# EAGLE board DRI-flexpcb-12s4p (EAGLE 9.5.2)
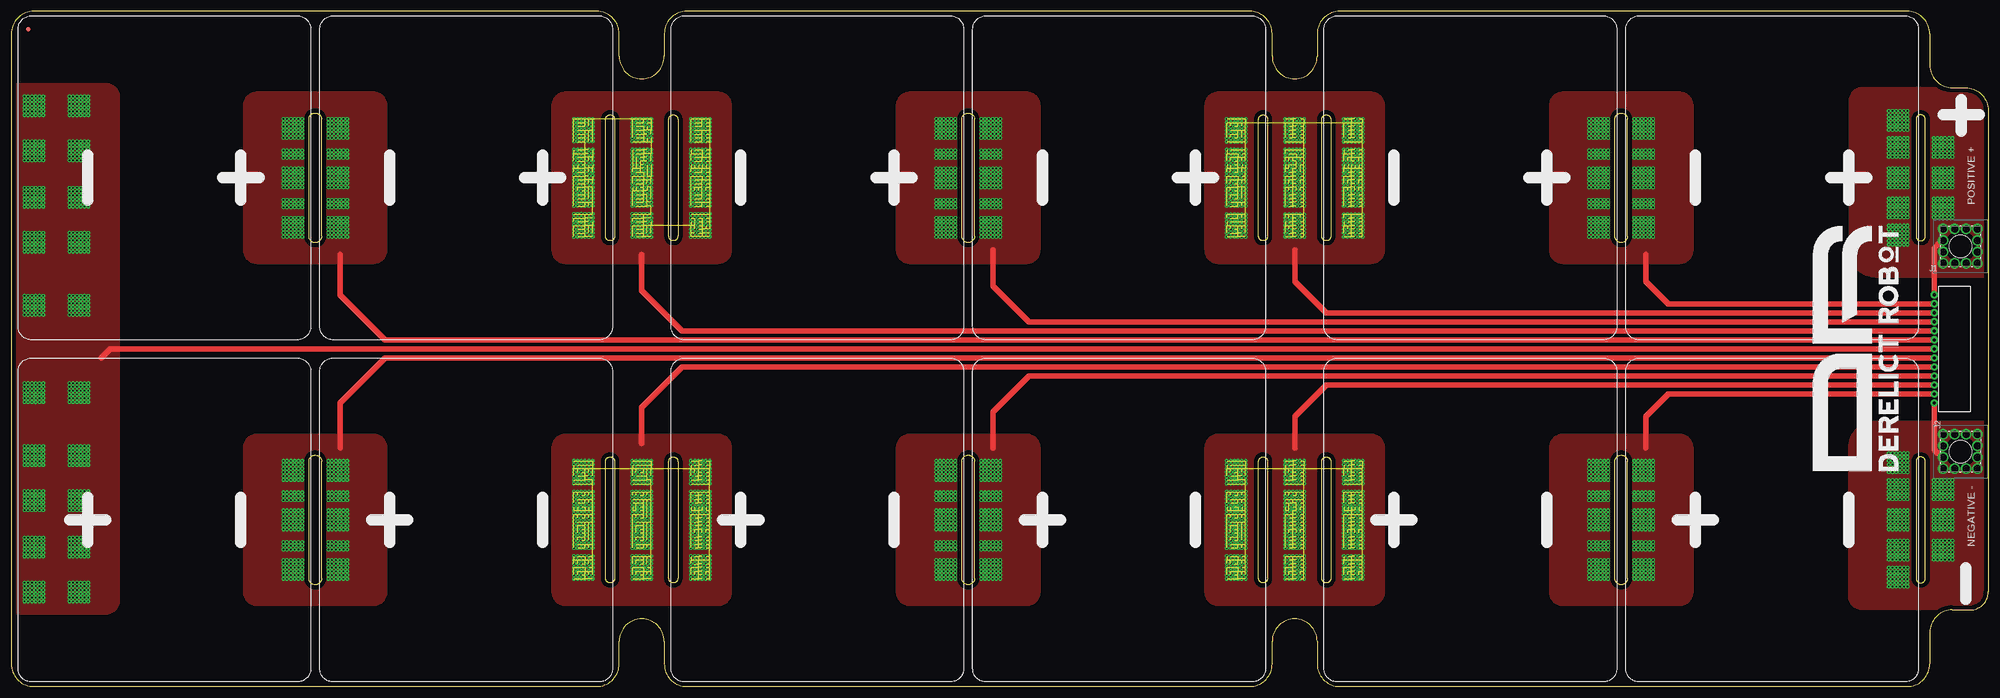
[diagram p1: board, top side]
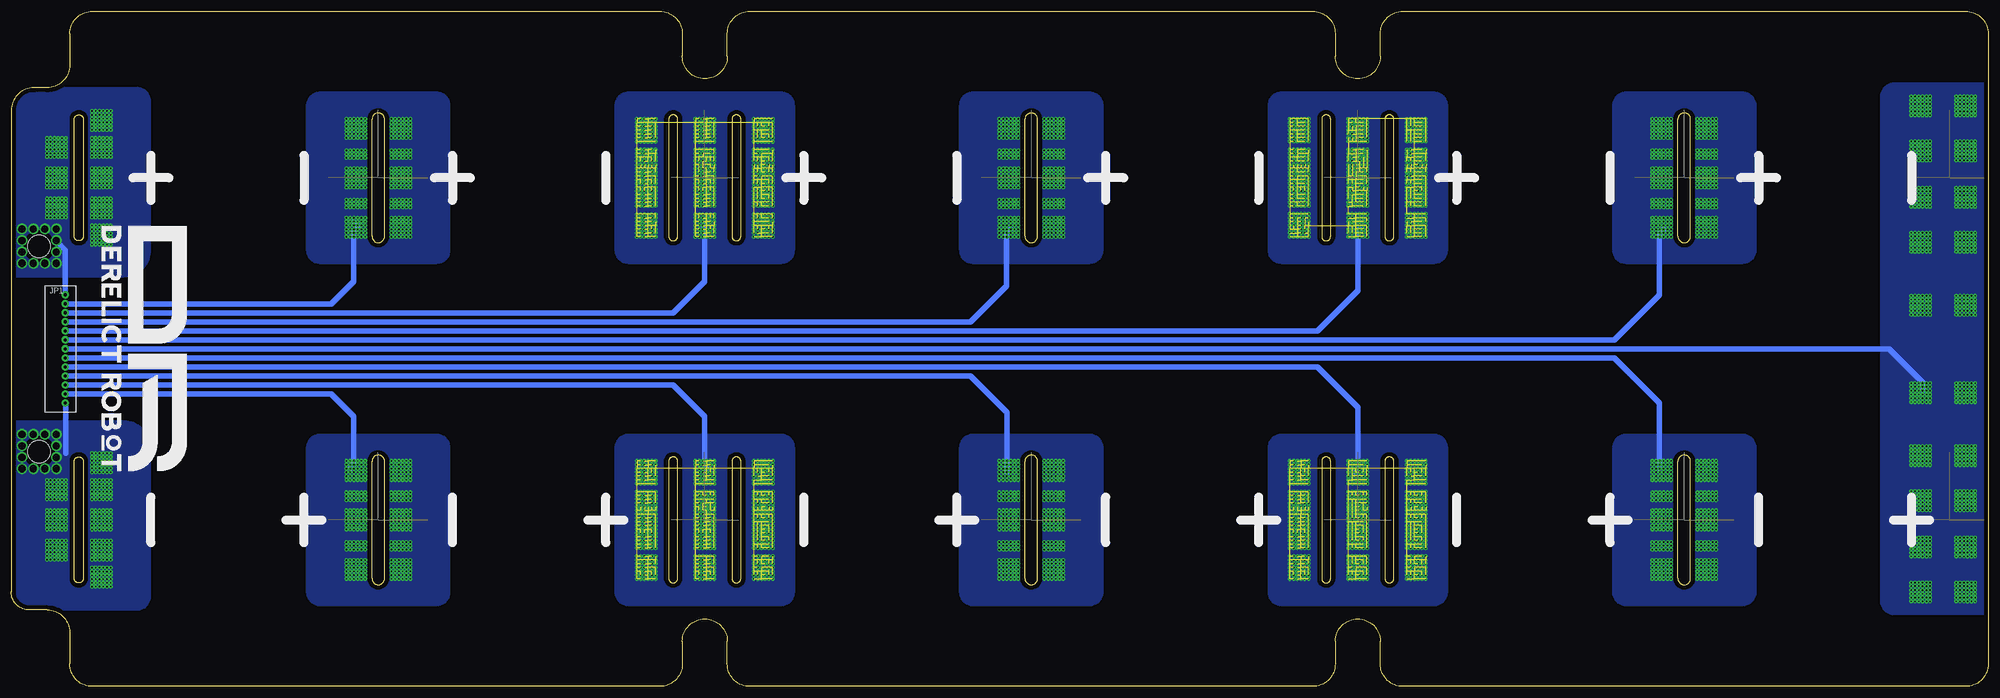
[diagram p2: board, bottom side, seen from below]

Size 439 x 150 mm. Coordinates in mm from the lower left corner, seen from the top.
Outline: 426,145 426,138 arc90 431,133 434,133 arc-90 439,128 439,127 439,21 arc-90 435,17 431,17 arc90 426,12 426,5 arc-90 421,0 295,0 arc-90 290,5 290,10 arc180 280,10 280,5 arc-90 275,0 150,0 arc-90 145,5 145,10 arc180 135,10 135,5 arc-90 130,0 5,0 arc-90 0,5 0,145 arc-90 5,150 130,150 arc-90 135,145 135,140 arc180 145,140 145,145 arc-90 150,150 275,150 arc-90 280,145 280,140 arc180 290,140 290,145 arc-90 295,150 421,150 arc-90 426,145
Copper layers (1*16): Top 0.035mm / dielectric 1.5mm / Bottom 0.035mm
Design rules "default": minimum track width 6mil, minimum drill 0.35mm, track to track 6mil, track to pad 6mil, pad to pad 6mil, via to via 6mil, smd to smd 6mil, copper to edge 40mil, drill to drill 6mil, minimum pad ring 10mil, minimum via ring 8mil, stop-mask expansion 4mil, vias tented up to drill 0mil, thermal gap 10mil

## Footprints (pad centres in the part's own frame; a part is rotated, then mirrored left to right if it is on the bottom)
FIDUCIAL-1X2 = smd 1 x 1: 1 0,0
7460408 = drill 1.57 pad 2.3: 1 0,0; 2 2.54,0; 3 5.08,0; 4 7.62,0; 5 7.62,2.54; 6 7.62,5.08; 7 7.62,7.62; 8 5.08,7.62; 9 2.54,7.62; 10 0,7.62; 11 0,5.08; 12 0,2.54 | hole 5: 3.81,3.81
13P-JST-2MM = drill 0.7 pad 1.6: P$1 0,-12; P$2 0,-10; P$3 0,-8; P$4 0,-6; P$5 0,-4; P$6 0,-2; P$7 0,0; P$8 0,2; P$9 0,4; P$10 0,6; P$11 0,8; P$12 0,10; P$13 0,12
TERM-PAD- = drill 0.3 pad 0.6: P$3 -1.26,0.42; P$4 -0.42,0.42; P$5 -0.42,-0.42; P$6 0.42,-0.42; P$7 0.42,0.42; P$8 -2.1,0.42; P$9 -2.1,1.26; P$10 -2.1,2.1; P$11 -1.26,2.1; P$12 -1.26,1.26; P$13 -0.42,1.26; P$14 -0.42,2.1; P$15 0.42,2.1; P$16 0.42,1.26; P$17 1.26,1.26; P$18 1.26,2.1; P$19 2.1,2.1; P$20 2.1,1.26; P$21 2.1,0.42; P$22 1.26,0.42; P$23 1.26,-0.42; P$24 2.1,-0.42; P$25 -1.26,-0.42; P$26 -2.1,-0.42; P$27 -2.1,-1.26; P$28 -2.1,-2.1; P$29 -1.26,-2.1; P$30 -0.42,-2.1; P$31 0.42,-2.1; P$32 1.26,-2.1; P$33 2.1,-2.1; P$34 2.1,-1.26; P$35 1.26,-1.26; P$36 -0.42,-1.26; P$37 0.42,-1.26; P$38 -1.26,-1.26; P$39 -0.42,7.14; P$40 0.42,7.14; P$41 -1.26,7.14; P$42 -2.1,7.14; P$43 -2.1,7.98; P$44 -2.1,8.82; P$45 -1.26,8.82; P$46 -1.26,7.98; P$47 -0.42,7.98; P$48 -0.42,8.82; P$49 0.42,8.82; P$50 0.42,7.98; P$51 1.26,7.98; P$52 1.26,8.82; P$53 2.1,8.82; P$54 2.1,7.98; P$55 2.1,7.14; P$56 1.26,7.14; P$57 -0.42,4.62; P$58 0.42,4.62; P$59 -1.26,4.62; P$60 -2.1,4.62; P$61 -2.1,5.46; P$62 -2.1,6.3; P$63 -1.26,6.3; P$64 -1.26,5.46; P$65 -0.42,5.46; P$66 -0.42,6.3; P$67 0.42,6.3; P$68 0.42,5.46; P$69 1.26,5.46; P$70 1.26,6.3; P$71 2.1,6.3; P$72 2.1,5.46; P$73 2.1,4.62; P$74 1.26,4.62; P$75 -0.42,-8.82; P$76 0.42,-8.82; P$77 -1.26,-8.82; P$78 -2.1,-8.82; P$79 -2.1,-7.98; P$80 -2.1,-7.14; P$81 -1.26,-7.14; P$82 -1.26,-7.98; P$83 -0.42,-7.98; P$84 -0.42,-7.14; P$85 0.42,-7.14; P$86 0.42,-7.98; P$87 1.26,-7.98; P$88 1.26,-7.14; P$89 2.1,-7.14; P$90 2.1,-7.98; P$91 2.1,-8.82; P$92 1.26,-8.82; P$93 -0.42,-6.3; P$94 0.42,-6.3; P$95 -1.26,-6.3; P$96 -2.1,-6.3; P$97 -2.1,-5.46; P$98 -2.1,-4.62; P$99 -1.26,-4.62; P$100 -1.26,-5.46; P$101 -0.42,-5.46; P$102 -0.42,-4.62; P$103 0.42,-4.62; P$104 0.42,-5.46; P$105 1.26,-5.46; P$106 1.26,-4.62; P$107 2.1,-4.62; P$108 2.1,-5.46; P$109 2.1,-6.3; P$110 1.26,-6.3; P$181 -10.42,0.42; P$182 -10.42,-0.42; P$183 -9.58,-0.42; P$184 -9.58,0.42; P$185 -11.26,0.42; P$186 -12.1,0.42; P$187 -12.1,1.26; P$188 -12.1,2.1; P$189 -11.26,2.1; P$190 -11.26,1.26; P$191 -10.42,1.26; P$192 -10.42,2.1; P$193 -9.58,2.1; P$194 -9.58,1.26; P$195 -8.74,1.26; P$196 -8.74,2.1; P$197 -7.9,2.1; P$198 -7.9,1.26; P$199 -7.9,0.42; P$200 -8.74,0.42; P$201 -8.74,-0.42; P$202 -7.9,-0.42; P$203 -11.26,-0.42; P$204 -12.1,-0.42; P$205 -12.1,-1.26; P$206 -12.1,-2.1; P$207 -11.26,-2.1; P$208 -10.42,-2.1; P$209 -9.58,-2.1; P$210 -8.74,-2.1; P$211 -7.9,-2.1; P$212 -7.9,-1.26; P$213 -8.74,-1.26; P$214 -10.42,-1.26; P$215 -9.58,-1.26; P$216 -11.26,-1.26; P$217 -10.42,7.14; P$218 -9.58,7.14; P$219 -11.26,7.14; P$220 -12.1,7.14; P$221 -12.1,7.98; P$222 -12.1,8.82; P$223 -11.26,8.82; P$224 -11.26,7.98; P$225 -10.42,7.98; P$226 -10.42,8.82; P$227 -9.58,8.82; P$228 -9.58,7.98; P$229 -8.74,7.98; P$230 -8.74,8.82; P$231 -7.9,8.82; P$232 -7.9,7.98; P$233 -7.9,7.14; P$234 -8.74,7.14; P$235 -10.42,4.62; P$236 -9.58,4.62; P$237 -11.26,4.62; P$238 -12.1,4.62; P$239 -12.1,5.46; P$240 -12.1,6.3; P$241 -11.26,6.3; P$242 -11.26,5.46; P$243 -10.42,5.46; P$244 -10.42,6.3; P$245 -9.58,6.3; P$246 -9.58,5.46; P$247 -8.74,5.46; P$248 -8.74,6.3; P$249 -7.9,6.3; P$250 -7.9,5.46; P$251 -7.9,4.62; P$252 -8.74,4.62; P$253 -10.42,-8.82; P$254 -9.58,-8.82; P$255 -11.26,-8.82; P$256 -12.1,-8.82; P$257 -12.1,-7.98; P$258 -12.1,-7.14; P$259 -11.26,-7.14; P$260 -11.26,-7.98; P$261 -10.42,-7.98; P$262 -10.42,-7.14; P$263 -9.58,-7.14; P$264 -9.58,-7.98; P$265 -8.74,-7.98; P$266 -8.74,-7.14; P$267 -7.9,-7.14; P$268 -7.9,-7.98; P$269 -7.9,-8.82; P$270 -8.74,-8.82; P$271 -10.42,-6.3; P$272 -9.58,-6.3; P$273 -11.26,-6.3; P$274 -12.1,-6.3; P$275 -12.1,-5.46; P$276 -12.1,-4.62; P$277 -11.26,-4.62; P$278 -11.26,-5.46; P$279 -10.42,-5.46; P$280 -10.42,-4.62; P$281 -9.58,-4.62; P$282 -9.58,-5.46; P$283 -8.74,-5.46; P$284 -8.74,-4.62; P$285 -7.9,-4.62; P$286 -7.9,-5.46; P$287 -7.9,-6.3; P$288 -8.74,-6.3; P$289 -10.42,13.14; P$290 -9.58,13.14; P$291 -11.26,13.14; P$292 -12.1,13.14; P$293 -12.1,13.98; P$294 -12.1,14.82; P$295 -11.26,14.82; P$296 -11.26,13.98; P$297 -10.42,13.98; P$298 -10.42,14.82; P$299 -9.58,14.82; P$300 -9.58,13.98; P$301 -8.74,13.98; P$302 -8.74,14.82; P$303 -7.9,14.82; P$304 -7.9,13.98; P$305 -7.9,13.14; P$306 -8.74,13.14; P$307 -10.42,10.62; P$308 -9.58,10.62; P$309 -11.26,10.62; P$310 -12.1,10.62; P$311 -12.1,11.46; P$312 -12.1,12.3; P$313 -11.26,12.3; P$314 -11.26,11.46; P$315 -10.42,11.46; P$316 -10.42,12.3; P$317 -9.58,12.3; P$318 -9.58,11.46; P$319 -8.74,11.46; P$320 -8.74,12.3; P$321 -7.9,12.3; P$322 -7.9,11.46; P$323 -7.9,10.62; P$324 -8.74,10.62; P$325 -10.42,-14.82; P$326 -9.58,-14.82; P$327 -11.26,-14.82; P$328 -12.1,-14.82; P$329 -12.1,-13.98; P$330 -12.1,-13.14; P$331 -11.26,-13.14; P$332 -11.26,-13.98; P$333 -10.42,-13.98; P$334 -10.42,-13.14; P$335 -9.58,-13.14; P$336 -9.58,-13.98; P$337 -8.74,-13.98; P$338 -8.74,-13.14; P$339 -7.9,-13.14; P$340 -7.9,-13.98; P$341 -7.9,-14.82; P$342 -8.74,-14.82; P$343 -10.42,-12.3; P$344 -9.58,-12.3; P$345 -11.26,-12.3; P$346 -12.1,-12.3; P$347 -12.1,-11.46; P$348 -12.1,-10.62; P$349 -11.26,-10.62; P$350 -11.26,-11.46; P$351 -10.42,-11.46; P$352 -10.42,-10.62; P$353 -9.58,-10.62; P$354 -9.58,-11.46; P$355 -8.74,-11.46; P$356 -8.74,-10.62; P$357 -7.9,-10.62; P$358 -7.9,-11.46; P$359 -7.9,-12.3; P$360 -8.74,-12.3
BAT-TERM-L = drill 0.3 pad 0.6: P$1 -5.42,-6.58; P$2 -4.58,-6.58; P$3 -4.58,-5.74; P$4 -4.58,-4.9; P$5 -5.42,0.42; P$6 -4.58,0.42; P$7 -4.58,-0.42; P$8 -5.42,-0.42; P$9 -5.42,-1.26; P$10 -5.42,-2.1; P$11 -6.26,-2.1; P$12 -7.1,-2.1; P$13 -4.58,1.26; P$14 -4.58,2.1; P$15 -3.74,2.1; P$16 -2.9,2.1; P$17 -3.74,0.42; P$18 -2.9,0.42; P$19 -2.9,1.26; P$20 -3.74,1.26; P$21 -3.74,-1.26; P$22 -3.74,-0.42; P$23 -2.9,-0.42; P$24 -2.9,-1.26; P$25 -2.9,-2.1; P$26 -3.74,-2.1; P$27 -4.58,-2.1; P$28 -4.58,-1.26; P$29 -6.26,-1.26; P$30 -7.1,-1.26; P$31 -7.1,-0.42; P$32 -6.26,-0.42; P$33 -6.26,0.42; P$34 -7.1,0.42; P$35 -7.1,1.26; P$36 -6.26,1.26; P$37 -6.26,2.1; P$38 -7.1,2.1; P$39 -5.42,1.26; P$40 -5.42,2.1; P$41 -5.42,-10.58; P$42 4.58,0.42; P$43 5.42,0.42; P$44 5.42,-0.42; P$45 4.58,-0.42; P$46 4.58,-1.26; P$47 4.58,-2.1; P$48 3.74,-2.1; P$49 2.9,-2.1; P$50 5.42,1.26; P$51 5.42,2.1; P$52 6.26,2.1; P$53 7.1,2.1; P$54 6.26,0.42; P$55 7.1,0.42; P$56 7.1,1.26; P$57 6.26,1.26; P$58 6.26,-1.26; P$59 6.26,-0.42; P$60 7.1,-0.42; P$61 7.1,-1.26; P$62 7.1,-2.1; P$63 6.26,-2.1; P$64 5.42,-2.1; P$65 5.42,-1.26; P$66 3.74,-1.26; P$67 2.9,-1.26; P$68 2.9,-0.42; P$69 3.74,-0.42; P$70 3.74,0.42; P$71 2.9,0.42; P$72 2.9,1.26; P$73 3.74,1.26; P$74 3.74,2.1; P$75 2.9,2.1; P$76 4.58,1.26; P$77 4.58,2.1; P$78 -4.58,-10.58; P$79 -4.58,-11.42; P$80 -5.42,-11.42; P$81 -5.42,-12.26; P$82 -5.42,-13.1; P$83 -6.26,-13.1; P$84 -7.1,-13.1; P$85 -4.58,-9.74; P$86 -4.58,-8.9; P$87 -3.74,-8.9; P$88 -2.9,-8.9; P$89 -3.74,-10.58; P$90 -2.9,-10.58; P$91 -2.9,-9.74; P$92 -3.74,-9.74; P$93 -3.74,-12.26; P$94 -3.74,-11.42; P$95 -2.9,-11.42; P$96 -2.9,-12.26; P$97 -2.9,-13.1; P$98 -3.74,-13.1; P$99 -4.58,-13.1; P$100 -4.58,-12.26; P$101 -6.26,-12.26; P$102 -7.1,-12.26; P$103 -7.1,-11.42; P$104 -6.26,-11.42; P$105 -6.26,-10.58; P$106 -7.1,-10.58; P$107 -7.1,-9.74; P$108 -6.26,-9.74; P$109 -6.26,-8.9; P$110 -7.1,-8.9; P$111 -5.42,-9.74; P$112 -5.42,-8.9; P$113 -3.74,-4.9; P$114 -5.42,11.42; P$115 -4.58,11.42; P$116 -4.58,10.58; P$117 -5.42,10.58; P$118 -5.42,9.74; P$119 -5.42,8.9; P$120 -6.26,8.9; P$121 -7.1,8.9; P$122 -4.58,12.26; P$123 -4.58,13.1; P$124 -3.74,13.1; P$125 -2.9,13.1; P$126 -3.74,11.42; P$127 -2.9,11.42; P$128 -2.9,12.26; P$129 -3.74,12.26; P$130 -3.74,9.74; P$131 -3.74,10.58; P$132 -2.9,10.58; P$133 -2.9,9.74; P$134 -2.9,8.9; P$135 -3.74,8.9; P$136 -4.58,8.9; P$137 -4.58,9.74; P$138 -6.26,9.74; P$139 -7.1,9.74; P$140 -7.1,10.58; P$141 -6.26,10.58; P$142 -6.26,11.42; P$143 -7.1,11.42; P$144 -7.1,12.26; P$145 -6.26,12.26; P$146 -6.26,13.1; P$147 -7.1,13.1; P$148 -5.42,12.26; P$149 -5.42,13.1; P$150 -2.9,-4.9; P$151 4.58,11.42; P$152 5.42,11.42; P$153 5.42,10.58; P$154 4.58,10.58; P$155 4.58,9.74; P$156 4.58,8.9; P$157 3.74,8.9; P$158 2.9,8.9; P$159 5.42,12.26; P$160 5.42,13.1; P$161 6.26,13.1; P$162 7.1,13.1; P$163 6.26,11.42; P$164 7.1,11.42; P$165 7.1,12.26; P$166 6.26,12.26; P$167 6.26,9.74; P$168 6.26,10.58; P$169 7.1,10.58; P$170 7.1,9.74; P$171 7.1,8.9; P$172 6.26,8.9; P$173 5.42,8.9; P$174 5.42,9.74; P$175 3.74,9.74; P$176 2.9,9.74; P$177 2.9,10.58; P$178 3.74,10.58; P$179 3.74,11.42; P$180 2.9,11.42; P$181 2.9,12.26; P$182 3.74,12.26; P$183 3.74,13.1; P$184 2.9,13.1; P$185 4.58,12.26; P$186 4.58,13.1; P$187 -3.74,-6.58; P$188 4.58,-10.58; P$189 5.42,-10.58; P$190 5.42,-11.42; P$191 4.58,-11.42; P$192 4.58,-12.26; P$193 4.58,-13.1; P$194 3.74,-13.1; P$195 2.9,-13.1; P$196 5.42,-9.74; P$197 5.42,-8.9; P$198 6.26,-8.9; P$199 7.1,-8.9; P$200 6.26,-10.58; P$201 7.1,-10.58; P$202 7.1,-9.74; P$203 6.26,-9.74; P$204 6.26,-12.26; P$205 6.26,-11.42; P$206 7.1,-11.42; P$207 7.1,-12.26; P$208 7.1,-13.1; P$209 6.26,-13.1; P$210 5.42,-13.1; P$211 5.42,-12.26; P$212 3.74,-12.26; P$213 2.9,-12.26; P$214 2.9,-11.42; P$215 3.74,-11.42; P$216 3.74,-10.58; P$217 2.9,-10.58; P$218 2.9,-9.74; P$219 3.74,-9.74; P$220 3.74,-8.9; P$221 2.9,-8.9; P$222 4.58,-9.74; P$223 4.58,-8.9; P$224 -2.9,-6.58; P$225 -2.9,-5.74; P$226 -3.74,-5.74; P$227 -6.26,-6.58; P$228 -7.1,-6.58; P$229 -7.1,-5.74; P$230 -6.26,-5.74; P$231 -6.26,-4.9; P$232 -7.1,-4.9; P$233 -5.42,-5.74; P$234 -5.42,-4.9; P$235 4.58,-6.58; P$236 5.42,-6.58; P$237 5.42,-5.74; P$238 5.42,-4.9; P$239 6.26,-4.9; P$240 7.1,-4.9; P$241 6.26,-6.58; P$242 7.1,-6.58; P$243 7.1,-5.74; P$244 6.26,-5.74; P$245 3.74,-6.58; P$246 2.9,-6.58; P$247 2.9,-5.74; P$248 3.74,-5.74; P$249 3.74,-4.9; P$250 2.9,-4.9; P$251 4.58,-5.74; P$252 4.58,-4.9; P$253 -5.42,4.42; P$254 -4.58,4.42; P$255 -4.58,5.26; P$256 -4.58,6.1; P$257 -3.74,6.1; P$258 -2.9,6.1; P$259 -3.74,4.42; P$260 -2.9,4.42; P$261 -2.9,5.26; P$262 -3.74,5.26; P$263 -6.26,4.42; P$264 -7.1,4.42; P$265 -7.1,5.26; P$266 -6.26,5.26; P$267 -6.26,6.1; P$268 -7.1,6.1; P$269 -5.42,5.26; P$270 -5.42,6.1; P$271 4.58,4.42; P$272 5.42,4.42; P$273 5.42,5.26; P$274 5.42,6.1; P$275 6.26,6.1; P$276 7.1,6.1; P$277 6.26,4.42; P$278 7.1,4.42; P$279 7.1,5.26; P$280 6.26,5.26; P$281 3.74,4.42; P$282 2.9,4.42; P$283 2.9,5.26; P$284 3.74,5.26; P$285 3.74,6.1; P$286 2.9,6.1; P$287 4.58,5.26; P$288 4.58,6.1
BAT-TERM-M = drill 0.3 pad 0.6: P$1 -15.08,-0.42; P$2 -15.08,0.42; P$3 -2.08,4.58; P$4 -2.08,5.42; P$5 -14.24,0.42; P$6 -13.4,0.42; P$7 -2.08,-0.42; P$8 -2.08,0.42; P$9 -1.24,0.42; P$10 -0.4,0.42; P$11 -0.4,1.26; P$12 -0.4,2.1; P$13 -1.24,-0.42; P$14 -0.4,-0.42; P$15 -0.4,-1.26; P$16 -0.4,-2.1; P$17 -1.24,-2.1; P$18 -2.08,-2.1; P$19 -13.4,1.26; P$20 -1.24,5.42; P$21 -13.4,2.1; P$22 -2.08,-8.08; P$23 -1.24,-8.08; P$24 -0.4,5.42; P$25 -0.4,6.26; P$26 -14.24,-0.42; P$27 -2.08,-1.26; P$28 -1.24,-1.26; P$29 -1.24,1.26; P$30 -1.24,2.1; P$31 -2.08,2.1; P$32 -2.08,1.26; P$33 -13.4,-0.42; P$34 -13.4,-1.26; P$35 -13.4,-2.1; P$36 -1.24,4.58; P$37 -0.4,4.58; P$38 -0.4,-8.08; P$39 -0.4,3.74; P$40 2.08,-8.08; P$41 -0.4,2.9; P$42 2.08,0.42; P$43 2.08,-0.42; P$44 -14.24,-2.1; P$45 -15.08,-2.1; P$46 -1.24,2.9; P$47 -15.08,-1.26; P$48 -2.08,2.9; P$49 1.24,-8.08; P$50 -14.24,-1.26; P$51 0.4,-8.08; P$52 -14.24,1.26; P$53 -2.08,8.02; P$54 -14.24,2.1; P$55 -15.08,2.1; P$56 2.08,-2.1; P$57 1.24,-2.1; P$58 0.4,-2.1; P$59 0.4,-1.26; P$60 0.4,-0.42; P$61 1.24,-0.42; P$62 1.24,-1.26; P$63 2.08,-1.26; P$64 -15.08,1.26; P$65 -2.08,3.74; P$66 -1.24,3.74; P$67 -1.24,6.26; P$68 -10.92,0.42; P$69 -10.92,-0.42; P$70 2.08,1.26; P$71 2.08,2.1; P$72 1.24,2.1; P$73 1.24,1.26; P$74 1.24,0.42; P$75 0.4,0.42; P$76 0.4,1.26; P$77 0.4,2.1; P$78 -10.92,-2.1; P$79 -11.76,-2.1; P$80 -12.6,-2.1; P$81 -2.08,10.58; P$82 -2.08,11.42; P$83 -1.24,11.42; P$84 -0.4,11.42; P$85 -0.4,12.26; P$86 -0.4,13.1; P$87 -1.24,10.58; P$88 -0.4,10.58; P$89 -0.4,9.74; P$90 -0.4,8.9; P$91 -1.24,8.9; P$92 -2.08,8.9; P$93 -12.6,-1.26; P$94 -12.6,-0.42; P$95 -1.24,8.02; P$96 -0.4,8.02; P$97 -2.08,6.26; P$98 -11.76,-0.42; P$99 -11.76,-1.26; P$100 -10.92,-1.26; P$101 -2.08,9.74; P$102 -1.24,9.74; P$103 -1.24,12.26; P$104 -1.24,13.1; P$105 -2.08,13.1; P$106 -2.08,12.26; P$107 -10.92,1.26; P$108 -10.92,2.1; P$109 2.08,5.42; P$110 2.08,4.58; P$111 -11.76,2.1; P$112 2.08,8.02; P$113 -11.76,1.26; P$114 -11.76,0.42; P$115 -12.6,0.42; P$116 -12.6,1.26; P$117 -12.6,2.1; P$118 -2.08,-11.42; P$119 -2.08,-10.58; P$120 -1.24,-10.58; P$121 -0.4,-10.58; P$122 -0.4,-9.74; P$123 -0.4,-8.9; P$124 -1.24,-11.42; P$125 -0.4,-11.42; P$126 -0.4,-12.26; P$127 -0.4,-13.1; P$128 -1.24,-13.1; P$129 -2.08,-13.1; P$130 -15.08,10.58; P$131 2.08,2.9; P$132 1.24,8.02; P$133 0.4,8.02; P$134 1.24,2.9; P$135 0.4,2.9; P$136 0.4,3.74; P$137 -15.08,11.42; P$138 -2.08,-12.26; P$139 -1.24,-12.26; P$140 -1.24,-9.74; P$141 -1.24,-8.9; P$142 -2.08,-8.9; P$143 -2.08,-9.74; P$144 -14.24,11.42; P$145 -13.4,11.42; P$146 0.4,4.58; P$147 1.24,4.58; P$148 1.24,3.74; P$149 2.08,3.74; P$150 -13.4,12.26; P$151 -13.4,13.1; P$152 -14.24,10.58; P$153 2.08,-10.58; P$154 2.08,-11.42; P$155 -13.4,10.58; P$156 -13.4,9.74; P$157 2.08,6.26; P$158 -13.4,8.9; P$159 -14.24,8.9; P$160 1.24,6.26; P$161 1.24,5.42; P$162 0.4,5.42; P$163 0.4,6.26; P$164 -15.08,8.9; P$165 -15.08,9.74; P$166 -14.24,9.74; P$167 2.08,-13.1; P$168 1.24,-13.1; P$169 0.4,-13.1; P$170 0.4,-12.26; P$171 0.4,-11.42; P$172 1.24,-11.42; P$173 1.24,-12.26; P$174 2.08,-12.26; P$175 -14.24,12.26; P$176 -14.24,13.1; P$177 -2.08,-5.42; P$178 -2.08,-4.58; P$179 -15.08,13.1; P$180 -15.08,12.26; P$181 2.08,-9.74; P$182 2.08,-8.9; P$183 1.24,-8.9; P$184 1.24,-9.74; P$185 1.24,-10.58; P$186 0.4,-10.58; P$187 0.4,-9.74; P$188 0.4,-8.9; P$189 -1.24,-4.58; P$190 2.08,11.42; P$191 2.08,10.58; P$192 -15.08,-11.42; P$193 -15.08,-10.58; P$194 -0.4,-4.58; P$195 -0.4,-3.74; P$196 -0.4,-2.9; P$197 -1.24,-5.42; P$198 -0.4,-5.42; P$199 -0.4,-6.26; P$200 -14.24,-10.58; P$201 -13.4,-10.58; P$202 -13.4,-9.74; P$203 -13.4,-8.9; P$204 2.08,8.9; P$205 1.24,8.9; P$206 0.4,8.9; P$207 0.4,9.74; P$208 0.4,10.58; P$209 1.24,10.58; P$210 1.24,9.74; P$211 2.08,9.74; P$212 -14.24,-11.42; P$213 -13.4,-11.42; P$214 -13.4,-12.26; P$215 -2.08,-6.26; P$216 -13.4,-13.1; P$217 -14.24,-13.1; P$218 2.08,12.26; P$219 2.08,13.1; P$220 1.24,13.1; P$221 1.24,12.26; P$222 1.24,11.42; P$223 0.4,11.42; P$224 0.4,12.26; P$225 0.4,13.1; P$226 -1.24,-6.26; P$227 -1.24,-3.74; P$228 -1.24,-2.9; P$229 -2.08,-2.9; P$230 -2.08,-3.74; P$231 -15.08,-13.1; P$232 -15.08,-12.26; P$233 2.08,-4.58; P$234 2.08,-5.42; P$235 -14.24,-12.26; P$236 -14.24,-9.74; P$237 -14.24,-8.9; P$238 -15.08,-8.9; P$239 -15.08,-9.74; P$240 -10.92,-10.58; P$241 0.4,-6.26; P$242 0.4,-5.42; P$243 1.24,-5.42; P$244 1.24,-6.26; P$245 2.08,-6.26; P$246 -10.92,-11.42; P$247 -10.92,-13.1; P$248 -11.76,-13.1; P$249 2.08,-3.74; P$250 2.08,-2.9; P$251 1.24,-2.9; P$252 1.24,-3.74; P$253 1.24,-4.58; P$254 0.4,-4.58; P$255 0.4,-3.74; P$256 0.4,-2.9; P$257 -12.6,-13.1; P$258 -12.6,-12.26; P$259 -12.6,-11.42; P$260 -11.76,-11.42; P$261 -11.76,-12.26; P$262 -10.92,-12.26; P$263 -10.92,-9.74; P$264 -10.92,-8.9; P$265 -11.76,-8.9; P$266 -11.76,-9.74; P$267 -11.76,-10.58; P$268 -12.6,-10.58; P$269 -12.6,-9.74; P$270 -12.6,-8.9; P$271 -10.92,11.42; P$272 -10.92,10.58; P$273 -10.92,8.9; P$274 -11.76,8.9; P$275 -12.6,8.9; P$276 -12.6,9.74; P$277 -12.6,10.58; P$278 -11.76,10.58; P$279 -11.76,9.74; P$280 -10.92,9.74; P$281 -10.92,12.26; P$282 -10.92,13.1; P$283 -11.76,13.1; P$284 -11.76,12.26; P$285 -11.76,11.42; P$286 -12.6,11.42; P$287 -12.6,12.26; P$288 -12.6,13.1; P$289 -15.08,-8.08; P$290 -14.24,-8.08; P$291 -13.4,-8.08; P$292 -10.92,-8.08; P$293 -11.76,-8.08; P$294 -12.6,-8.08; P$295 -15.08,8.02; P$296 -14.24,8.02; P$297 -13.4,8.02; P$298 -10.92,8.02; P$299 -11.76,8.02; P$300 -12.6,8.02; P$301 -15.08,4.58; P$302 -15.08,5.42; P$303 -14.24,5.42; P$304 -13.4,5.42; P$305 -13.4,6.26; P$306 -14.24,4.58; P$307 -13.4,4.58; P$308 -13.4,3.74; P$309 -13.4,2.9; P$310 -14.24,2.9; P$311 -15.08,2.9; P$312 -15.08,3.74; P$313 -14.24,3.74; P$314 -14.24,6.26; P$315 -15.08,6.26; P$316 -10.92,5.42; P$317 -10.92,4.58; P$318 -10.92,2.9; P$319 -11.76,2.9; P$320 -12.6,2.9; P$321 -12.6,3.74; P$322 -12.6,4.58; P$323 -11.76,4.58; P$324 -11.76,3.74; P$325 -10.92,3.74; P$326 -10.92,6.26; P$327 -11.76,6.26; P$328 -11.76,5.42; P$329 -12.6,5.42; P$330 -12.6,6.26; P$331 -15.08,-5.42; P$332 -15.08,-4.58; P$333 -14.24,-4.58; P$334 -13.4,-4.58; P$335 -13.4,-3.74; P$336 -13.4,-2.9; P$337 -14.24,-5.42; P$338 -13.4,-5.42; P$339 -13.4,-6.26; P$340 -15.08,-6.26; P$341 -14.24,-6.26; P$342 -14.24,-3.74; P$343 -14.24,-2.9; P$344 -15.08,-2.9; P$345 -15.08,-3.74; P$346 -10.92,-4.58; P$347 -10.92,-5.42; P$348 -12.6,-6.26; P$349 -12.6,-5.42; P$350 -11.76,-5.42; P$351 -11.76,-6.26; P$352 -10.92,-6.26; P$353 -10.92,-3.74; P$354 -10.92,-2.9; P$355 -11.76,-2.9; P$356 -11.76,-3.74; P$357 -11.76,-4.58; P$358 -12.6,-4.58; P$359 -12.6,-3.74; P$360 -12.6,-2.9; P$361 10.92,-0.42; P$362 10.92,0.42; P$363 11.76,0.42; P$364 12.6,0.42; P$365 12.6,1.26; P$366 12.6,2.1; P$367 11.76,-0.42; P$368 12.6,-0.42; P$369 12.6,-1.26; P$370 12.6,-2.1; P$371 11.76,-2.1; P$372 10.92,-2.1; P$373 10.92,-1.26; P$374 11.76,-1.26; P$375 11.76,1.26; P$376 11.76,2.1; P$377 10.92,2.1; P$378 10.92,1.26; P$379 15.08,0.42; P$380 15.08,-0.42; P$381 15.08,-2.1; P$382 14.24,-2.1; P$383 13.4,-2.1; P$384 13.4,-1.26; P$385 13.4,-0.42; P$386 14.24,-0.42; P$387 14.24,-1.26; P$388 15.08,-1.26; P$389 15.08,1.26; P$390 15.08,2.1; P$391 14.24,2.1; P$392 14.24,1.26; P$393 14.24,0.42; P$394 13.4,0.42; P$395 13.4,1.26; P$396 13.4,2.1; P$397 10.92,10.58; P$398 10.92,11.42; P$399 11.76,11.42; P$400 12.6,11.42; P$401 12.6,12.26; P$402 12.6,13.1; P$403 11.76,10.58; P$404 12.6,10.58; P$405 12.6,9.74; P$406 12.6,8.9; P$407 11.76,8.9; P$408 10.92,8.9; P$409 10.92,9.74; P$410 11.76,9.74; P$411 11.76,12.26; P$412 11.76,13.1; P$413 10.92,13.1; P$414 10.92,12.26; P$415 10.92,-11.42; P$416 10.92,-10.58; P$417 11.76,-10.58; P$418 12.6,-10.58; P$419 12.6,-9.74; P$420 12.6,-8.9; P$421 11.76,-11.42; P$422 12.6,-11.42; P$423 12.6,-12.26; P$424 12.6,-13.1; P$425 11.76,-13.1; P$426 10.92,-13.1; P$427 10.92,-12.26; P$428 11.76,-12.26; P$429 11.76,-9.74; P$430 11.76,-8.9; P$431 10.92,-8.9; P$432 10.92,-9.74; P$433 15.08,-10.58; P$434 15.08,-11.42; P$435 15.08,-13.1; P$436 14.24,-13.1; P$437 13.4,-13.1; P$438 13.4,-12.26; P$439 13.4,-11.42; P$440 14.24,-11.42; P$441 14.24,-12.26; P$442 15.08,-12.26; P$443 15.08,-9.74; P$444 15.08,-8.9; P$445 14.24,-8.9; P$446 14.24,-9.74; P$447 14.24,-10.58; P$448 13.4,-10.58; P$449 13.4,-9.74; P$450 13.4,-8.9; P$451 15.08,11.42; P$452 15.08,10.58; P$453 15.08,8.9; P$454 14.24,8.9; P$455 13.4,8.9; P$456 13.4,9.74; P$457 13.4,10.58; P$458 14.24,10.58; P$459 14.24,9.74; P$460 15.08,9.74; P$461 15.08,12.26; P$462 15.08,13.1; P$463 14.24,13.1; P$464 14.24,12.26; P$465 14.24,11.42; P$466 13.4,11.42; P$467 13.4,12.26; P$468 13.4,13.1; P$469 10.92,-8.08; P$470 11.76,-8.08; P$471 12.6,-8.08; P$472 15.08,-8.08; P$473 14.24,-8.08; P$474 13.4,-8.08; P$475 10.92,8.02; P$476 11.76,8.02; P$477 12.6,8.02; P$478 15.08,8.02; P$479 14.24,8.02; P$480 13.4,8.02; P$481 10.92,4.58; P$482 10.92,5.42; P$483 11.76,5.42; P$484 12.6,5.42; P$485 12.6,6.26; P$486 11.76,4.58; P$487 12.6,4.58; P$488 12.6,3.74; P$489 12.6,2.9; P$490 11.76,2.9; P$491 10.92,2.9; P$492 10.92,3.74; P$493 11.76,3.74; P$494 11.76,6.26; P$495 10.92,6.26; P$496 15.08,5.42; P$497 15.08,4.58; P$498 15.08,2.9; P$499 14.24,2.9; P$500 13.4,2.9; P$501 13.4,3.74; P$502 13.4,4.58; P$503 14.24,4.58; P$504 14.24,3.74; P$505 15.08,3.74; P$506 15.08,6.26; P$507 14.24,6.26; P$508 14.24,5.42; P$509 13.4,5.42; P$510 13.4,6.26; P$511 10.92,-5.42; P$512 10.92,-4.58; P$513 11.76,-4.58; P$514 12.6,-4.58; P$515 12.6,-3.74; P$516 12.6,-2.9; P$517 11.76,-5.42; P$518 12.6,-5.42; P$519 12.6,-6.26; P$520 10.92,-6.26; P$521 11.76,-6.26; P$522 11.76,-3.74; P$523 11.76,-2.9; P$524 10.92,-2.9; P$525 10.92,-3.74; P$526 15.08,-4.58; P$527 15.08,-5.42; P$528 13.4,-6.26; P$529 13.4,-5.42; P$530 14.24,-5.42; P$531 14.24,-6.26; P$532 15.08,-6.26; P$533 15.08,-3.74; P$534 15.08,-2.9; P$535 14.24,-2.9; P$536 14.24,-3.74; P$537 14.24,-4.58; P$538 13.4,-4.58; P$539 13.4,-3.74; P$540 13.4,-2.9
BAT-TERM-END = drill 0.3 pad 0.6: P$1 3.58,14.42; P$2 3.58,4.42; P$3 3.58,3.58; P$4 4.42,3.58; P$5 4.42,4.42; P$6 3.58,5.26; P$7 3.58,6.1; P$8 2.74,6.1; P$9 1.9,6.1; P$10 1.9,5.26; P$11 1.9,4.42; P$12 1.9,3.58; P$13 1.9,2.74; P$14 1.9,1.9; P$15 2.74,1.9; P$16 3.58,1.9; P$17 5.26,1.9; P$18 4.42,1.9; P$19 6.1,1.9; P$20 6.1,2.74; P$21 6.1,3.58; P$22 6.1,4.42; P$23 6.1,5.26; P$24 6.1,6.1; P$25 5.26,6.1; P$26 4.42,6.1; P$27 4.42,5.26; P$28 5.26,5.26; P$29 5.26,4.42; P$30 5.26,3.58; P$31 5.26,2.74; P$32 4.42,2.74; P$33 3.58,2.74; P$34 2.74,2.74; P$35 2.74,3.58; P$36 2.74,4.42; P$37 2.74,5.26; P$38 3.58,13.58; P$39 13.58,4.42; P$40 13.58,3.58; P$41 14.42,3.58; P$42 14.42,4.42; P$43 13.58,5.26; P$44 13.58,6.1; P$45 12.74,6.1; P$46 11.9,6.1; P$47 11.9,5.26; P$48 11.9,4.42; P$49 11.9,3.58; P$50 11.9,2.74; P$51 11.9,1.9; P$52 12.74,1.9; P$53 13.58,1.9; P$54 15.26,1.9; P$55 14.42,1.9; P$56 16.1,1.9; P$57 16.1,2.74; P$58 16.1,3.58; P$59 16.1,4.42; P$60 16.1,5.26; P$61 16.1,6.1; P$62 15.26,6.1; P$63 14.42,6.1; P$64 14.42,5.26; P$65 15.26,5.26; P$66 15.26,4.42; P$67 15.26,3.58; P$68 15.26,2.74; P$69 14.42,2.74; P$70 13.58,2.74; P$71 12.74,2.74; P$72 12.74,3.58; P$73 12.74,4.42; P$74 12.74,5.26; P$75 4.42,13.58; P$76 3.58,24.72; P$77 3.58,23.88; P$78 4.42,23.88; P$79 4.42,24.72; P$80 3.58,25.56; P$81 3.58,26.4; P$82 2.74,26.4; P$83 1.9,26.4; P$84 1.9,25.56; P$85 1.9,24.72; P$86 1.9,23.88; P$87 1.9,23.04; P$88 1.9,22.2; P$89 2.74,22.2; P$90 3.58,22.2; P$91 5.26,22.2; P$92 4.42,22.2; P$93 6.1,22.2; P$94 6.1,23.04; P$95 6.1,23.88; P$96 6.1,24.72; P$97 6.1,25.56; P$98 6.1,26.4; P$99 5.26,26.4; P$100 4.42,26.4; P$101 4.42,25.56; P$102 5.26,25.56; P$103 5.26,24.72; P$104 5.26,23.88; P$105 5.26,23.04; P$106 4.42,23.04; P$107 3.58,23.04; P$108 2.74,23.04; P$109 2.74,23.88; P$110 2.74,24.72; P$111 2.74,25.56; P$112 4.42,14.42; P$113 13.58,24.72; P$114 13.58,23.88; P$115 14.42,23.88; P$116 14.42,24.72; P$117 13.58,25.56; P$118 13.58,26.4; P$119 12.74,26.4; P$120 11.9,26.4; P$121 11.9,25.56; P$122 11.9,24.72; P$123 11.9,23.88; P$124 11.9,23.04; P$125 11.9,22.2; P$126 12.74,22.2; P$127 13.58,22.2; P$128 15.26,22.2; P$129 14.42,22.2; P$130 16.1,22.2; P$131 16.1,23.04; P$132 16.1,23.88; P$133 16.1,24.72; P$134 16.1,25.56; P$135 16.1,26.4; P$136 15.26,26.4; P$137 14.42,26.4; P$138 14.42,25.56; P$139 15.26,25.56; P$140 15.26,24.72; P$141 15.26,23.88; P$142 15.26,23.04; P$143 14.42,23.04; P$144 13.58,23.04; P$145 12.74,23.04; P$146 12.74,23.88; P$147 12.74,24.72; P$148 12.74,25.56; P$149 3.58,15.26; P$150 14.42,111.58; P$151 14.42,112.42; P$152 13.58,112.42; P$153 13.58,111.58; P$154 14.42,110.74; P$155 14.42,109.9; P$156 15.26,109.9; P$157 16.1,109.9; P$158 16.1,110.74; P$159 16.1,111.58; P$160 16.1,112.42; P$161 16.1,113.26; P$162 16.1,114.1; P$163 15.26,114.1; P$164 14.42,114.1; P$165 12.74,114.1; P$166 13.58,114.1; P$167 11.9,114.1; P$168 11.9,113.26; P$169 11.9,112.42; P$170 11.9,111.58; P$171 11.9,110.74; P$172 11.9,109.9; P$173 12.74,109.9; P$174 13.58,109.9; P$175 13.58,110.74; P$176 12.74,110.74; P$177 12.74,111.58; P$178 12.74,112.42; P$179 12.74,113.26; P$180 13.58,113.26; P$181 14.42,113.26; P$182 15.26,113.26; P$183 15.26,112.42; P$184 15.26,111.58; P$185 15.26,110.74; P$186 3.58,16.1; P$187 4.42,111.58; P$188 4.42,112.42; P$189 3.58,112.42; P$190 3.58,111.58; P$191 4.42,110.74; P$192 4.42,109.9; P$193 5.26,109.9; P$194 6.1,109.9; P$195 6.1,110.74; P$196 6.1,111.58; P$197 6.1,112.42; P$198 6.1,113.26; P$199 6.1,114.1; P$200 5.26,114.1; P$201 4.42,114.1; P$202 2.74,114.1; P$203 3.58,114.1; P$204 1.9,114.1; P$205 1.9,113.26; P$206 1.9,112.42; P$207 1.9,111.58; P$208 1.9,110.74; P$209 1.9,109.9; P$210 2.74,109.9; P$211 3.58,109.9; P$212 3.58,110.74; P$213 2.74,110.74; P$214 2.74,111.58; P$215 2.74,112.42; P$216 2.74,113.26; P$217 3.58,113.26; P$218 4.42,113.26; P$219 5.26,113.26; P$220 5.26,112.42; P$221 5.26,111.58; P$222 5.26,110.74; P$223 2.74,16.1; P$224 14.42,91.28; P$225 14.42,92.12; P$226 13.58,92.12; P$227 13.58,91.28; P$228 14.42,90.44; P$229 14.42,89.6; P$230 15.26,89.6; P$231 16.1,89.6; P$232 16.1,90.44; P$233 16.1,91.28; P$234 16.1,92.12; P$235 16.1,92.96; P$236 16.1,93.8; P$237 15.26,93.8; P$238 14.42,93.8; P$239 12.74,93.8; P$240 13.58,93.8; P$241 11.9,93.8; P$242 11.9,92.96; P$243 11.9,92.12; P$244 11.9,91.28; P$245 11.9,90.44; P$246 11.9,89.6; P$247 12.74,89.6; P$248 13.58,89.6; P$249 13.58,90.44; P$250 12.74,90.44; P$251 12.74,91.28; P$252 12.74,92.12; P$253 12.74,92.96; P$254 13.58,92.96; P$255 14.42,92.96; P$256 15.26,92.96; P$257 15.26,92.12; P$258 15.26,91.28; P$259 15.26,90.44; P$260 1.9,16.1; P$261 4.42,91.28; P$262 4.42,92.12; P$263 3.58,92.12; P$264 3.58,91.28; P$265 4.42,90.44; P$266 4.42,89.6; P$267 5.26,89.6; P$268 6.1,89.6; P$269 6.1,90.44; P$270 6.1,91.28; P$271 6.1,92.12; P$272 6.1,92.96; P$273 6.1,93.8; P$274 5.26,93.8; P$275 4.42,93.8; P$276 2.74,93.8; P$277 3.58,93.8; P$278 1.9,93.8; P$279 1.9,92.96; P$280 1.9,92.12; P$281 1.9,91.28; P$282 1.9,90.44; P$283 1.9,89.6; P$284 2.74,89.6; P$285 3.58,89.6; P$286 3.58,90.44; P$287 2.74,90.44; P$288 2.74,91.28; P$289 2.74,92.12; P$290 2.74,92.96; P$291 3.58,92.96; P$292 4.42,92.96; P$293 5.26,92.96; P$294 5.26,92.12; P$295 5.26,91.28; P$296 5.26,90.44; P$297 1.9,15.26; P$298 1.9,14.42; P$299 1.9,13.58; P$300 1.9,12.74; P$301 1.9,11.9; P$302 2.74,11.9; P$303 3.58,11.9; P$304 5.26,11.9; P$305 4.42,11.9; P$306 6.1,11.9; P$307 6.1,12.74; P$308 6.1,13.58; P$309 6.1,14.42; P$310 6.1,15.26; P$311 6.1,16.1; P$312 5.26,16.1; P$313 4.42,16.1; P$314 4.42,15.26; P$315 5.26,15.26; P$316 5.26,14.42; P$317 5.26,13.58; P$318 5.26,12.74; P$319 4.42,12.74; P$320 3.58,12.74; P$321 2.74,12.74; P$322 2.74,13.58; P$323 2.74,14.42; P$324 2.74,15.26; P$325 13.58,14.42; P$326 13.58,13.58; P$327 14.42,13.58; P$328 14.42,14.42; P$329 13.58,15.26; P$330 13.58,16.1; P$331 12.74,16.1; P$332 11.9,16.1; P$333 11.9,15.26; P$334 11.9,14.42; P$335 11.9,13.58; P$336 11.9,12.74; P$337 11.9,11.9; P$338 12.74,11.9; P$339 13.58,11.9; P$340 15.26,11.9; P$341 14.42,11.9; P$342 16.1,11.9; P$343 16.1,12.74; P$344 16.1,13.58; P$345 16.1,14.42; P$346 16.1,15.26; P$347 16.1,16.1; P$348 15.26,16.1; P$349 14.42,16.1; P$350 14.42,15.26; P$351 15.26,15.26; P$352 15.26,14.42; P$353 15.26,13.58; P$354 15.26,12.74; P$355 14.42,12.74; P$356 13.58,12.74; P$357 12.74,12.74; P$358 12.74,13.58; P$359 12.74,14.42; P$360 12.74,15.26; P$361 3.58,34.72; P$362 3.58,33.88; P$363 4.42,33.88; P$364 4.42,34.72; P$365 3.58,35.56; P$366 3.58,36.4; P$367 2.74,36.4; P$368 1.9,36.4; P$369 1.9,35.56; P$370 1.9,34.72; P$371 1.9,33.88; P$372 1.9,33.04; P$373 1.9,32.2; P$374 2.74,32.2; P$375 3.58,32.2; P$376 5.26,32.2; P$377 4.42,32.2; P$378 6.1,32.2; P$379 6.1,33.04; P$380 6.1,33.88; P$381 6.1,34.72; P$382 6.1,35.56; P$383 6.1,36.4; P$384 5.26,36.4; P$385 4.42,36.4; P$386 4.42,35.56; P$387 5.26,35.56; P$388 5.26,34.72; P$389 5.26,33.88; P$390 5.26,33.04; P$391 4.42,33.04; P$392 3.58,33.04; P$393 2.74,33.04; P$394 2.74,33.88; P$395 2.74,34.72; P$396 2.74,35.56; P$397 13.58,34.72; P$398 13.58,33.88; P$399 14.42,33.88; P$400 14.42,34.72; P$401 13.58,35.56; P$402 13.58,36.4; P$403 12.74,36.4; P$404 11.9,36.4; P$405 11.9,35.56; P$406 11.9,34.72; P$407 11.9,33.88; P$408 11.9,33.04; P$409 11.9,32.2; P$410 12.74,32.2; P$411 13.58,32.2; P$412 15.26,32.2; P$413 14.42,32.2; P$414 16.1,32.2; P$415 16.1,33.04; P$416 16.1,33.88; P$417 16.1,34.72; P$418 16.1,35.56; P$419 16.1,36.4; P$420 15.26,36.4; P$421 14.42,36.4; P$422 14.42,35.56; P$423 15.26,35.56; P$424 15.26,34.72; P$425 15.26,33.88; P$426 15.26,33.04; P$427 14.42,33.04; P$428 13.58,33.04; P$429 12.74,33.04; P$430 12.74,33.88; P$431 12.74,34.72; P$432 12.74,35.56; P$433 14.42,67.28; P$434 14.42,68.12; P$435 13.58,68.12; P$436 13.58,67.28; P$437 14.42,66.44; P$438 14.42,65.6; P$439 15.26,65.6; P$440 16.1,65.6; P$441 16.1,66.44; P$442 16.1,67.28; P$443 16.1,68.12; P$444 16.1,68.96; P$445 16.1,69.8; P$446 15.26,69.8; P$447 14.42,69.8; P$448 12.74,69.8; P$449 13.58,69.8; P$450 11.9,69.8; P$451 11.9,68.96; P$452 11.9,68.12; P$453 11.9,67.28; P$454 11.9,66.44; P$455 11.9,65.6; P$456 12.74,65.6; P$457 13.58,65.6; P$458 13.58,66.44; P$459 12.74,66.44; P$460 12.74,67.28; P$461 12.74,68.12; P$462 12.74,68.96; P$463 13.58,68.96; P$464 14.42,68.96; P$465 15.26,68.96; P$466 15.26,68.12; P$467 15.26,67.28; P$468 15.26,66.44; P$469 4.42,67.28; P$470 4.42,68.12; P$471 3.58,68.12; P$472 3.58,67.28; P$473 4.42,66.44; P$474 4.42,65.6; P$475 5.26,65.6; P$476 6.1,65.6; P$477 6.1,66.44; P$478 6.1,67.28; P$479 6.1,68.12; P$480 6.1,68.96; P$481 6.1,69.8; P$482 5.26,69.8; P$483 4.42,69.8; P$484 2.74,69.8; P$485 3.58,69.8; P$486 1.9,69.8; P$487 1.9,68.96; P$488 1.9,68.12; P$489 1.9,67.28; P$490 1.9,66.44; P$491 1.9,65.6; P$492 2.74,65.6; P$493 3.58,65.6; P$494 3.58,66.44; P$495 2.74,66.44; P$496 2.74,67.28; P$497 2.74,68.12; P$498 2.74,68.96; P$499 3.58,68.96; P$500 4.42,68.96; P$501 5.26,68.96; P$502 5.26,68.12; P$503 5.26,67.28; P$504 5.26,66.44; P$505 3.58,48.72; P$506 3.58,47.88; P$507 4.42,47.88; P$508 4.42,48.72; P$509 3.58,49.56; P$510 3.58,50.4; P$511 2.74,50.4; P$512 1.9,50.4; P$513 1.9,49.56; P$514 1.9,48.72; P$515 1.9,47.88; P$516 1.9,47.04; P$517 1.9,46.2; P$518 2.74,46.2; P$519 3.58,46.2; P$520 5.26,46.2; P$521 4.42,46.2; P$522 6.1,46.2; P$523 6.1,47.04; P$524 6.1,47.88; P$525 6.1,48.72; P$526 6.1,49.56; P$527 6.1,50.4; P$528 5.26,50.4; P$529 4.42,50.4; P$530 4.42,49.56; P$531 5.26,49.56; P$532 5.26,48.72; P$533 5.26,47.88; P$534 5.26,47.04; P$535 4.42,47.04; P$536 3.58,47.04; P$537 2.74,47.04; P$538 2.74,47.88; P$539 2.74,48.72; P$540 2.74,49.56; P$541 13.58,48.72; P$542 13.58,47.88; P$543 14.42,47.88; P$544 14.42,48.72; P$545 13.58,49.56; P$546 13.58,50.4; P$547 12.74,50.4; P$548 11.9,50.4; P$549 11.9,49.56; P$550 11.9,48.72; P$551 11.9,47.88; P$552 11.9,47.04; P$553 11.9,46.2; P$554 12.74,46.2; P$555 13.58,46.2; P$556 15.26,46.2; P$557 14.42,46.2; P$558 16.1,46.2; P$559 16.1,47.04; P$560 16.1,47.88; P$561 16.1,48.72; P$562 16.1,49.56; P$563 16.1,50.4; P$564 15.26,50.4; P$565 14.42,50.4; P$566 14.42,49.56; P$567 15.26,49.56; P$568 15.26,48.72; P$569 15.26,47.88; P$570 15.26,47.04; P$571 14.42,47.04; P$572 13.58,47.04; P$573 12.74,47.04; P$574 12.74,47.88; P$575 12.74,48.72; P$576 12.74,49.56; P$577 14.42,101.58; P$578 14.42,102.42; P$579 13.58,102.42; P$580 13.58,101.58; P$581 14.42,100.74; P$582 14.42,99.9; P$583 15.26,99.9; P$584 16.1,99.9; P$585 16.1,100.74; P$586 16.1,101.58; P$587 16.1,102.42; P$588 16.1,103.26; P$589 16.1,104.1; P$590 15.26,104.1; P$591 14.42,104.1; P$592 12.74,104.1; P$593 13.58,104.1; P$594 11.9,104.1; P$595 11.9,103.26; P$596 11.9,102.42; P$597 11.9,101.58; P$598 11.9,100.74; P$599 11.9,99.9; P$600 12.74,99.9; P$601 13.58,99.9; P$602 13.58,100.74; P$603 12.74,100.74; P$604 12.74,101.58; P$605 12.74,102.42; P$606 12.74,103.26; P$607 13.58,103.26; P$608 14.42,103.26; P$609 15.26,103.26; P$610 15.26,102.42; P$611 15.26,101.58; P$612 15.26,100.74; P$613 4.42,101.58; P$614 4.42,102.42; P$615 3.58,102.42; P$616 3.58,101.58; P$617 4.42,100.74; P$618 4.42,99.9; P$619 5.26,99.9; P$620 6.1,99.9; P$621 6.1,100.74; P$622 6.1,101.58; P$623 6.1,102.42; P$624 6.1,103.26; P$625 6.1,104.1; P$626 5.26,104.1; P$627 4.42,104.1; P$628 2.74,104.1; P$629 3.58,104.1; P$630 1.9,104.1; P$631 1.9,103.26; P$632 1.9,102.42; P$633 1.9,101.58; P$634 1.9,100.74; P$635 1.9,99.9; P$636 2.74,99.9; P$637 3.58,99.9; P$638 3.58,100.74; P$639 2.74,100.74; P$640 2.74,101.58; P$641 2.74,102.42; P$642 2.74,103.26; P$643 3.58,103.26; P$644 4.42,103.26; P$645 5.26,103.26; P$646 5.26,102.42; P$647 5.26,101.58; P$648 5.26,100.74; P$649 14.42,81.28; P$650 14.42,82.12; P$651 13.58,82.12; P$652 13.58,81.28; P$653 14.42,80.44; P$654 14.42,79.6; P$655 15.26,79.6; P$656 16.1,79.6; P$657 16.1,80.44; P$658 16.1,81.28; P$659 16.1,82.12; P$660 16.1,82.96; P$661 16.1,83.8; P$662 15.26,83.8; P$663 14.42,83.8; P$664 12.74,83.8; P$665 13.58,83.8; P$666 11.9,83.8; P$667 11.9,82.96; P$668 11.9,82.12; P$669 11.9,81.28; P$670 11.9,80.44; P$671 11.9,79.6; P$672 12.74,79.6; P$673 13.58,79.6; P$674 13.58,80.44; P$675 12.74,80.44; P$676 12.74,81.28; P$677 12.74,82.12; P$678 12.74,82.96; P$679 13.58,82.96; P$680 14.42,82.96; P$681 15.26,82.96; P$682 15.26,82.12; P$683 15.26,81.28; P$684 15.26,80.44; P$685 4.42,81.28; P$686 4.42,82.12; P$687 3.58,82.12; P$688 3.58,81.28; P$689 4.42,80.44; P$690 4.42,79.6; P$691 5.26,79.6; P$692 6.1,79.6; P$693 6.1,80.44; P$694 6.1,81.28; P$695 6.1,82.12; P$696 6.1,82.96; P$697 6.1,83.8; P$698 5.26,83.8; P$699 4.42,83.8; P$700 2.74,83.8; P$701 3.58,83.8; P$702 1.9,83.8; P$703 1.9,82.96; P$704 1.9,82.12; P$705 1.9,81.28; P$706 1.9,80.44; P$707 1.9,79.6; P$708 2.74,79.6; P$709 3.58,79.6; P$710 3.58,80.44; P$711 2.74,80.44; P$712 2.74,81.28; P$713 2.74,82.12; P$714 2.74,82.96; P$715 3.58,82.96; P$716 4.42,82.96; P$717 5.26,82.96; P$718 5.26,82.12; P$719 5.26,81.28; P$720 5.26,80.44

## Placement (x,y rotation side)
FD2  FIDUCIAL1X2  [FIDUCIAL-1X2]  3.81,146.05 0 top
J1  7460408  [7460408]  429,94 0 top
J2  7460408  [7460408]  429,56 270 top
JP1  13P-JST-2MM  [13P-JST-2MM]  427,75 0 bottom
P0  BUS-TERM-PAD-  [TERM-PAD-]  429,37 0 top
P1  BAT-TERM-L  [BAT-TERM-L]  357.5,37 0 top
P2  BAT-TERM-M  [BAT-TERM-M]  285,37 0 top
P3  BAT-TERM-L  [BAT-TERM-L]  212.5,37 0 top
P4  BAT-TERM-M  [BAT-TERM-M]  140,37 0 top
P5  BAT-TERM-L  [BAT-TERM-L]  67.5,37 0 top
P6  BAT-TERM-END  [BAT-TERM-END]  1,17 0 top
P7  BAT-TERM-L  [BAT-TERM-L]  67.5,113 0 top
P8  BAT-TERM-M  [BAT-TERM-M]  140,113 180 top
P9  BAT-TERM-L  [BAT-TERM-L]  212.5,113 0 top
P10  BAT-TERM-M  [BAT-TERM-M]  285,113 0 top
P11  BAT-TERM-L  [BAT-TERM-L]  357.5,113 0 top
P12  BUS-TERM-PAD+  [TERM-PAD-]  429,113 0 top
U$1  [4PBATTERY]  391,113 270 top
U$2  [4PBATTERY]  324,113 270 top
U$3  [4PBATTERY]  246,37 90 top
U$4  [4PBATTERY]  179,37 90 top
U$5  [4PBATTERY]  101,37 90 top
U$6  [4PBATTERY]  34,37 90 top
U$7  [4PBATTERY]  391,37 90 top
U$8  [4PBATTERY]  324,37 90 top
U$9  [4PBATTERY]  246,113 270 top
U$10  [4PBATTERY]  179,113 270 top
U$11  [4PBATTERY]  101,113 270 top
U$12  [4PBATTERY]  34,113 270 top

## Tracks (layer width: path | path; a pad name or v marks a point on that pad's centre or on a via)
P0-
  Top 1.27: 427.74,51.82 427,52.56 JP1.P$1
  Bottom 1.27: JP1.P$1 426.9,62.9 426.9,51.82
  pour Top (no thermals): 441,17 411,17 arc-90 408,20 408,53 arc-90 414,59 441,59
  pour Bottom (no thermals): 441,59 441,17 411,17 arc-90 408,20 408,53 arc-90 414,59
P1
  Top 1.27: JP1.P$2 368,65 363,60 363,53
  Bottom 1.27: JP1.P$2 368,65 363,60 363,49.18 P1.P$163
  pour Bottom: 344.5,56 370.5,56 arc-90 373.5,53 373.5,21 arc-90 370.5,18 344.5,18 arc-90 341.5,21 341.5,53 arc-90
  pour Top: 341.5,53 341.5,21 arc90 344.5,18 370.5,18 arc90 373.5,21 373.5,53 arc90 370.5,56 344.5,56 arc90
P2  (539 unrouted)
  Top 1.27: JP1.P$3 292,67 285,60 285,53
  Bottom 1.27: JP1.P$3 292,67 285,60 285,48.82 P2.P$84
  pour Top: 302,56 268,56 arc90 265,53 265,21 arc90 268,18 302,18 arc90 305,21 305,53 arc90
  pour Bottom: 302,18 268,18 arc-90 265,21 265,53 arc-90 268,56 302,56 arc-90 305,53 305,21 arc-90
P3
  Top 1.27: JP1.P$4 226,69 218,61 218,53
  Bottom 1.27: JP1.P$4 226,69 217.92,60.92 P3.P$153
  pour Top: 199.5,18 225.5,18 arc90 228.5,21 228.5,53 arc90 225.5,56 199.5,56 arc90 196.5,53 196.5,21 arc90
  pour Bottom: 196.5,21 196.5,53 arc-90 199.5,56 225.5,56 arc-90 228.5,53 228.5,21 arc-90 225.5,18 199.5,18 arc-90
P4  (539 unrouted)
  Top 1.27: JP1.P$5 149,71 140,62 140,54
  Bottom 1.27: JP1.P$5 149,71 140,62 140,47.98 P4.P$208
  pour Top: 157,56 123,56 arc90 120,53 120,21 arc90 123,18 157,18 arc90 160,21 160,53 arc90
  pour Bottom: 120,21 120,53 arc-90 123,56 157,56 arc-90 160,53 160,21 arc-90 157,18 123,18 arc-90
P5
  Top 1.27: JP1.P$6 83,73 73,63 73,53
  Bottom 1.27: JP1.P$6 83,73 73,63 73,48.5 P5.P$152
  pour Top: 80.5,56 54.5,56 arc90 51.5,53 51.5,21 arc90 54.5,18 80.5,18 arc90 83.5,21 83.5,53 arc90
  pour Bottom: 54.5,56 80.5,56 arc-90 83.5,53 83.5,21 arc-90 80.5,18 54.5,18 arc-90 51.5,21 51.5,53 arc-90
P6
  Top 1.27: JP1.P$7 22,75 20,73
  Bottom 1.27: JP1.P$7 22,75 14.58,67.58 P6.P$541
  pour Top: 0,134 21,134 arc-90 24,131 24,19 arc-90 21,16 0,16
  pour Bottom: 0,134 21,134 arc-90 24,131 24,19 arc-90 21,16 0,16
P7
  Top 1.27: JP1.P$8 83,77 73,87 73,96
  Bottom 1.27: JP1.P$8 83,77 73,87 73,100.66 P7.P$191
  pour Bottom: 54.5,132 80.5,132 arc-90 83.5,129 83.5,97 arc-90 80.5,94 54.5,94 arc-90 51.5,97 51.5,129 arc-90
  pour Top: 83.5,97 83.5,129 arc90 80.5,132 54.5,132 arc90 51.5,129 51.5,97 arc90 54.5,94 80.5,94 arc90
P8  (539 unrouted)
  Top 1.27: JP1.P$9 149,79 140,88 140,96
  Bottom 1.27: JP1.P$9 149,79 140,88 140,101.18 P8.P$223
  pour Top: 123,94 157,94 arc90 160,97 160,129 arc90 157,132 123,132 arc90 120,129 120,97 arc90
  pour Bottom: 120,97 120,129 arc-90 123,132 157,132 arc-90 160,129 160,97 arc-90 157,94 123,94 arc-90
P9
  Top 1.27: JP1.P$10 226,81 218,89 218,97
  Bottom 1.27: JP1.P$10 226,81 218,89 218,100.66 P9.P$191
  pour Top: 199.5,94 225.5,94 arc90 228.5,97 228.5,129 arc90 225.5,132 199.5,132 arc90 196.5,129 196.5,97 arc90
  pour Bottom: 196.5,97 196.5,129 arc-90 199.5,132 225.5,132 arc-90 228.5,129 228.5,97 arc-90 225.5,94 199.5,94 arc-90
P10  (539 unrouted)
  Top 1.27: JP1.P$11 292,83 285,90 285,97
  Bottom 1.27: JP1.P$11 292,83 285,90 285,102.02 P10.P$186
  pour Top: 305,97 305,129 arc90 302,132 268,132 arc90 265,129 265,97 arc90 268,94 302,94 arc90
  pour Bottom: 265,97 265,129 arc-90 268,132 302,132 arc-90 305,129 305,97 arc-90 302,94 268,94 arc-90
P11
  Top 1.27: JP1.P$12 368,85 363,90 363,96
  Bottom 1.27: JP1.P$12 368,85 363,90 363,101 362,102 362,102.34 P11.P$196
  pour Top: 370.5,132 344.5,132 arc90 341.5,129 341.5,97 arc90 344.5,94 370.5,94 arc90 373.5,97 373.5,129 arc90
  pour Bottom: 341.5,97 341.5,129 arc-90 344.5,132 370.5,132 arc-90 373.5,129 373.5,97 arc-90 370.5,94 344.5,94 arc-90
P12+
  Top 1.27: 428.58,99.02 427,97.44 JP1.P$13
  Bottom 1.27: JP1.P$13 427,97 429.02,99.02 429.42,99.02
  pour Bottom (no thermals): 441,133 441,91 414,91 arc-90 408,97 408,130 arc-90 411,133
  pour Top (no thermals): 441,133 411,133 arc90 408,130 408,97 arc90 414,91 441,91

## Text on the board
tPlace: POSITIVE + | NEGATIVE -
200bmp: C:/Users/andre/Desktop/DR-logo-mono.bmp | C:/Users/andre/Desktop/DR-logo-mono.bmp